# EAGLE design BrickPi 1.7.3 (EAGLE 6.4)
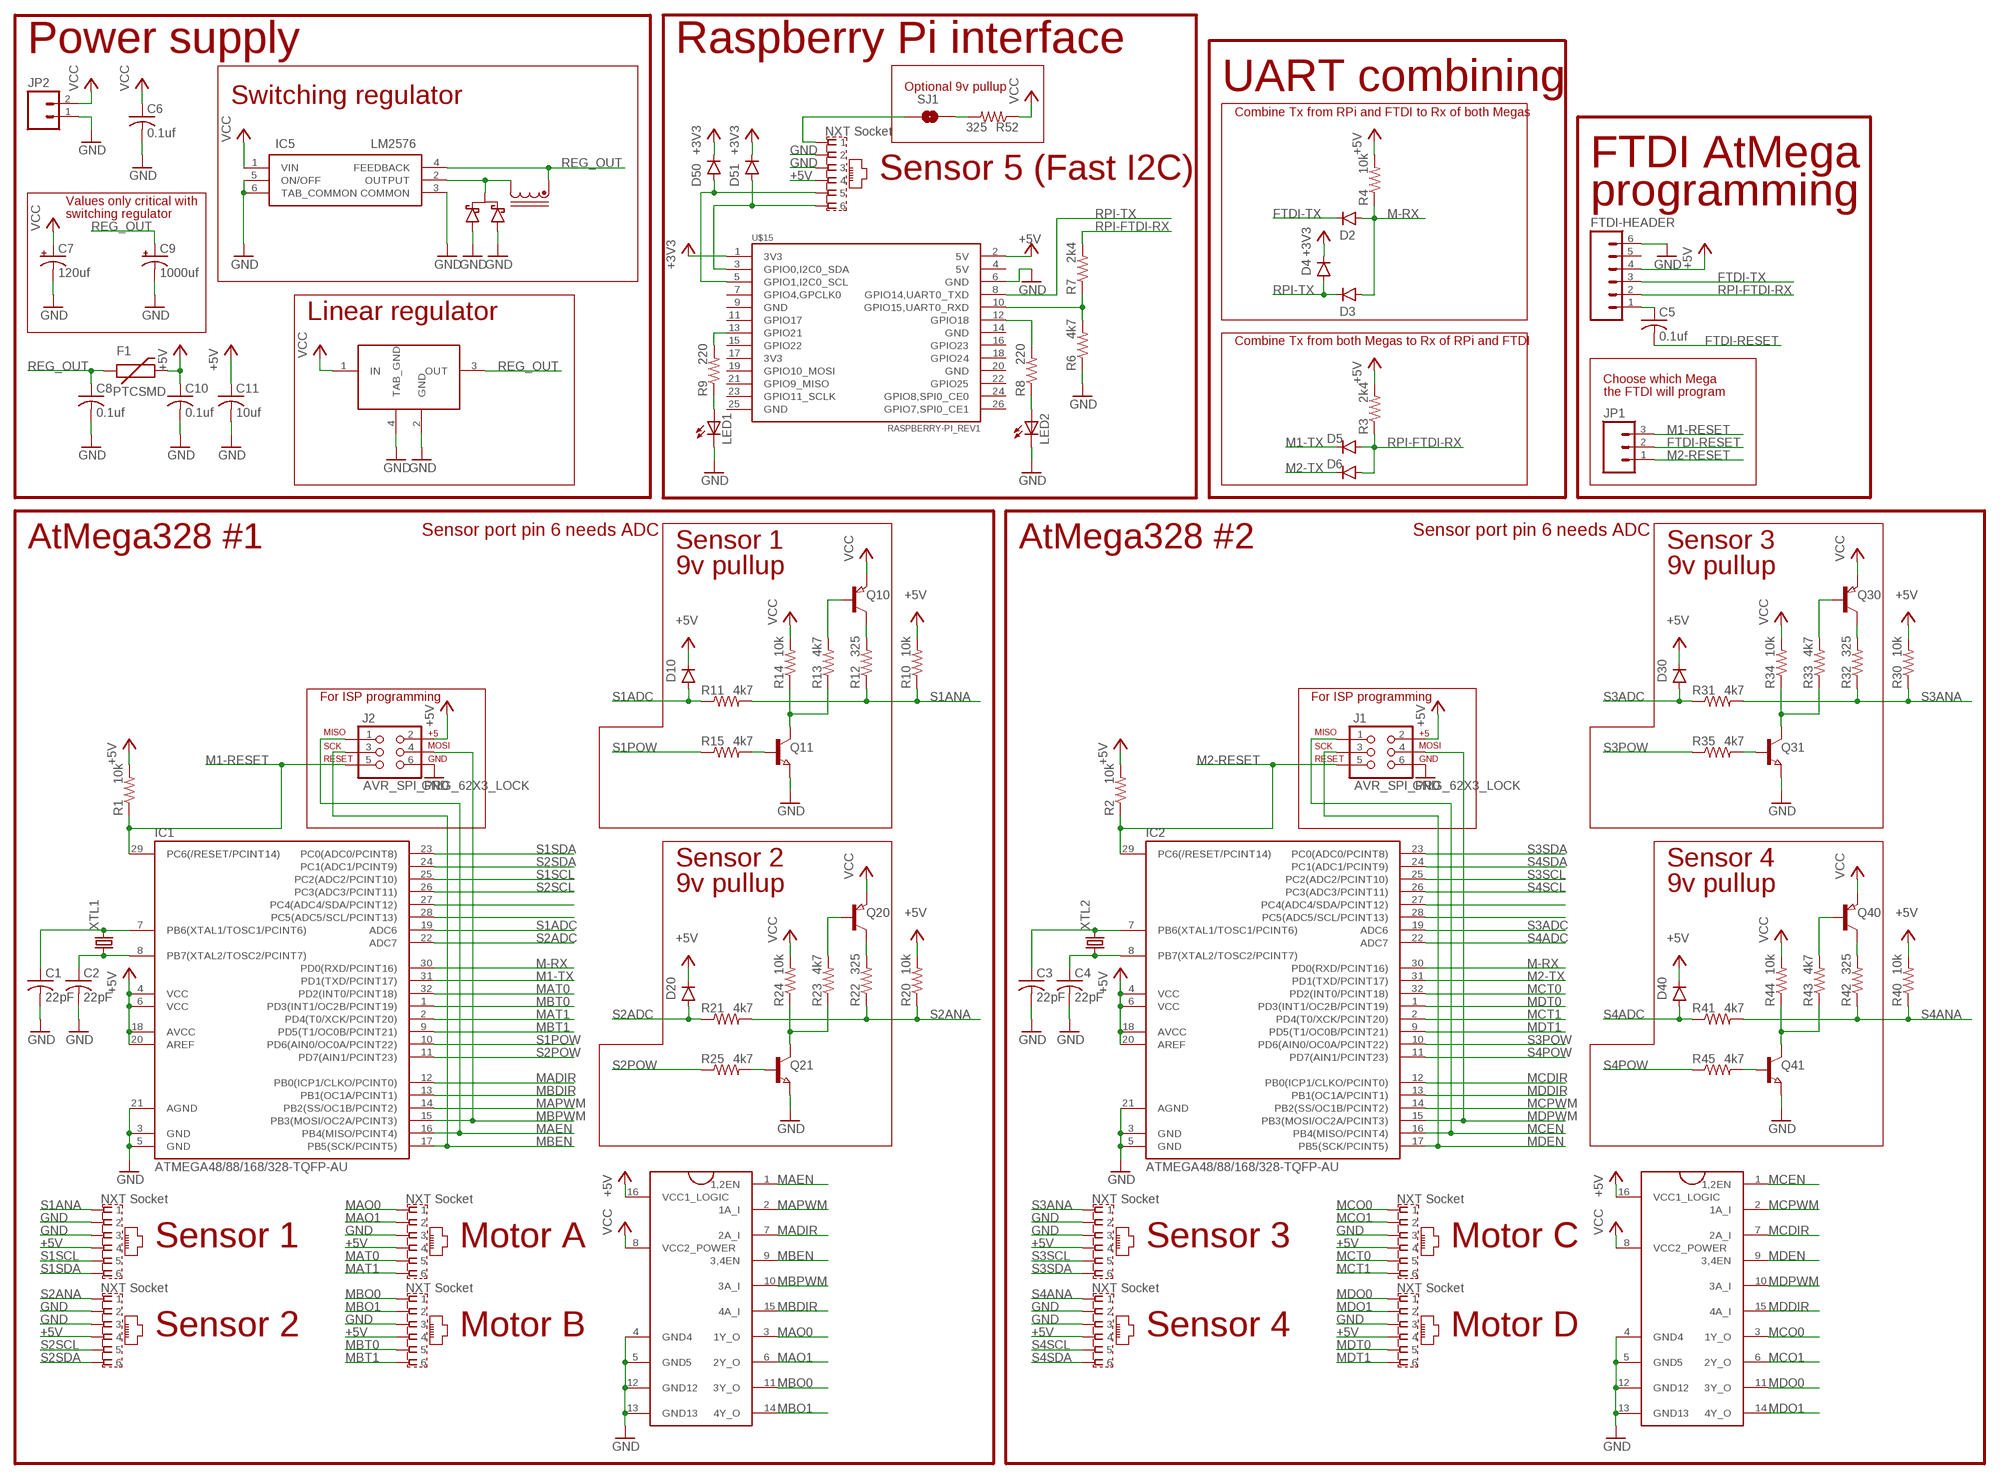
[diagram p0: schematic, sheet 1]

## Parts
C1  22pF  C-USC0805  [C0805]
C2  22pF  C-USC0805  [C0805]
C3  22pF  C-USC0805  [C0805]
C4  22pF  C-USC0805  [C0805]
C5  0.1uf  C-USC0805  [C0805]
C6  0.1uf  C-USC0805  [C0805]
C7  120uf  CPOL-USE2.5-6  [E2,5-6]
C8  0.1uf  C-USC0805  [C0805]
C9  1000uf  CPOL-USE3.5-10  [E3,5-10]
C10  0.1uf  C-USC0805  [C0805]
C11  10uf  C-USC0805  [C0805]
D1  DIODE_SCHOTTKY_VS-6CWQ04FNTRPBF  [DPAK]
D2  DIODESOD80  [SOD80]
D3  DIODESOD80  [SOD80]
D4  DIODESOD80  [SOD80]
D5  DIODESOD80  [SOD80]
D6  DIODESOD80  [SOD80]
D10  DIODESOD80  [SOD80]
D20  DIODESOD80  [SOD80]
D30  DIODESOD80  [SOD80]
D40  DIODESOD80  [SOD80]
D50  DIODESOD80  [SOD80]
D51  DIODESOD80  [SOD80]
F1  PTCSMD  [PTC-1206]
FTDI-HEADER  M06LOCK  [1X06_LOCK]
IC1  ATMEGA48/88/168/328-TQFP-AU  [TQFP32-08]
IC2  ATMEGA48/88/168/328-TQFP-AU  [TQFP32-08]
IC3  SN754410  [DIL16-ROUND-HEAT_DIS_SN754410]
IC4  SN754410  [DIL16-ROUND-HEAT_DIS_SN754410]
IC5  LM2576  REGULATOR_SWITCHING_LM2575_LM2576  [TO220-5-H]
IC6  REGULATOR_5V_TO220-H_7805  [TO220-H]
J1  AVR_SPI_PRG_62X3_LOCK  [2X3_LOCK]
J2  AVR_SPI_PRG_62X3_LOCK  [2X3_LOCK]
JP1  M03LOCK  [1X03_LOCK]
JP2  M02LOCK  [1X02_LOCK]
LED1  LED0805  [0805-LED]
LED2  LED0805  [0805-LED]
Q10  PNP-TRANSISTOR_SOT23  [SOT23]
Q11  NPN-TRANSISTOR_SOT23  [SOT23]
Q20  PNP-TRANSISTOR_SOT23  [SOT23]
Q21  NPN-TRANSISTOR_SOT23  [SOT23]
Q30  PNP-TRANSISTOR_SOT23  [SOT23]
Q31  NPN-TRANSISTOR_SOT23  [SOT23]
Q40  PNP-TRANSISTOR_SOT23  [SOT23]
Q41  NPN-TRANSISTOR_SOT23  [SOT23]
R1  10k  RESISTOR0603-RES  [0603]
R2  10k  RESISTOR0603-RES  [0603]
R3  2k4  RESISTOR0603-RES  [0603]
R4  10k  RESISTOR0603-RES  [0603]
R6  4k7  RESISTOR0603-RES  [0603]
R7  2k4  RESISTOR0603-RES  [0603]
R8  220  RESISTOR0603-RES  [0603]
R9  220  RESISTOR0603-RES  [0603]
R10  10k  RESISTOR0603-RES  [0603]
R11  4k7  RESISTOR0603-RES  [0603]
R12  325  RESISTOR1206  [1206]
R13  4k7  RESISTOR0603-RES  [0603]
R14  10k  RESISTOR0603-RES  [0603]
R15  4k7  RESISTOR0603-RES  [0603]
R20  10k  RESISTOR0603-RES  [0603]
R21  4k7  RESISTOR0603-RES  [0603]
R22  325  RESISTOR1206  [1206]
R23  4k7  RESISTOR0603-RES  [0603]
R24  10k  RESISTOR0603-RES  [0603]
R25  4k7  RESISTOR0603-RES  [0603]
R30  10k  RESISTOR0603-RES  [0603]
R31  4k7  RESISTOR0603-RES  [0603]
R32  325  RESISTOR1206  [1206]
R33  4k7  RESISTOR0603-RES  [0603]
R34  10k  RESISTOR0603-RES  [0603]
R35  4k7  RESISTOR0603-RES  [0603]
R40  10k  RESISTOR0603-RES  [0603]
R41  4k7  RESISTOR0603-RES  [0603]
R42  325  RESISTOR1206  [1206]
R43  4k7  RESISTOR0603-RES  [0603]
R44  10k  RESISTOR0603-RES  [0603]
R45  4k7  RESISTOR0603-RES  [0603]
R52  325  RESISTOR1206  [1206]
SJ1  SOLDERJUMPERNO  [SJ_2]
U$3  NXT-SOCKETREGULAR  [NXT-SOCKET]
U$4  NXT-SOCKETREGULAR  [NXT-SOCKET]
U$5  NXT-SOCKETREGULAR  [NXT-SOCKET]
U$7  NXT-SOCKETREGULAR  [NXT-SOCKET]
U$8  NXT-SOCKETREGULAR  [NXT-SOCKET]
U$9  NXT-SOCKETREGULAR  [NXT-SOCKET]
U$10  NXT-SOCKETREGULAR  [NXT-SOCKET]
U$11  NXT-SOCKETREGULAR  [NXT-SOCKET]
U$12  NXT-SOCKETREGULAR  [NXT-SOCKET]
U$14  INDUCTOR_PULSE_P0250.XXXNL  [INDUCTOR_PULSE_P0250.XXXNL]
U$15  RASPBERRY-PI_REV1  [RASPBERRY-PI_REV1]
XTL1  CRYSTALHC49S  [HC49/S]
XTL2  CRYSTALHC49S  [HC49/S]

## Nets
+3V3: D4.C D50.C D51.C U$15.1(3V3)
+5V: C10.1 C11.1 D10.C D20.C D30.C D40.C F1.2 FTDI-HEADER.4 IC1.4(VCC) IC1.6(VCC) IC1.18(AVCC) IC1.20(AREF) IC2.4(VCC) IC2.6(VCC) IC2.18(AVCC) IC2.20(AREF) IC3.16(VCC1_LOGIC) IC4.16(VCC1_LOGIC) J1.2 J2.2 R1.2 R2.2 R3.2 R4.2 R10.2 R20.2 R30.2 R40.2 U$3.4 U$4.4 U$5.4 U$7.4 U$8.4 U$9.4 U$10.4 U$11.4 U$12.4 U$15.2(5V)
FTDI-RESET: C5.2 JP1.2
FTDI-TX: D2.C FTDI-HEADER.3
GND: C1.2 C2.2 C3.2 C4.2 C6.2 C7.- C8.2 C9.- C10.2 C11.2 D1.1 D1.3 FTDI-HEADER.6 IC1.3(GND) IC1.5(GND) IC1.21(AGND) IC2.3(GND) IC2.5(GND) IC2.21(AGND) IC3.4(GND4) IC3.5(GND5) IC3.12(GND12) IC3.13(GND13) IC4.4(GND4) IC4.5(GND5) IC4.12(GND12) IC4.13(GND13) IC5.3(COMMON) IC5.5(ON/OFF) IC5.6(TAB_COMMON) IC6.2(GND) IC6.4(TAB_GND) J1.6 J2.6 JP2.1 LED1.2(C) LED2.2(C) Q11.2(E) Q21.2(E) Q31.2(E) Q41.2(E) R6.1 U$3.3 U$4.3 U$5.3 U$7.3 U$8.2 U$8.3 U$9.2 U$9.3 U$10.2 U$10.3 U$11.2 U$11.3 U$12.2 U$12.3 U$15.6(GND)
M1-RESET: IC1.29(PC6(/RESET/PCINT14)) J2.5 JP1.3 R1.1
M1-TX: D5.C IC1.31(PD1(TXD/PCINT17))
M2-RESET: IC2.29(PC6(/RESET/PCINT14)) J1.5 JP1.1 R2.1
M2-TX: D6.C IC2.31(PD1(TXD/PCINT17))
M-RX: D2.A D3.A IC1.30(PD0(RXD/PCINT16)) IC2.30(PD0(RXD/PCINT16)) R4.1
MADIR: IC1.12(PB0(ICP1/CLKO/PCINT0)) IC3.7(2A_I)
MAEN: IC1.16(PB4(MISO/PCINT4)) IC3.1(1,2EN) J2.1
MAO0: IC3.3(1Y_O) U$3.1
MAO1: IC3.6(2Y_O) U$3.2
MAPWM: IC1.14(PB2(SS/OC1B/PCINT2)) IC3.2(1A_I)
MAT0: IC1.32(PD2(INT0/PCINT18)) U$3.5
MAT1: IC1.2(PD4(T0/XCK/PCINT20)) U$3.6
MBDIR: IC1.13(PB1(OC1A/PCINT1)) IC3.15(4A_I)
MBEN: IC1.17(PB5(SCK/PCINT5)) IC3.9(3,4EN) J2.3
MBO0: IC3.11(3Y_O) U$4.1
MBO1: IC3.14(4Y_O) U$4.2
MBPWM: IC1.15(PB3(MOSI/OC2A/PCINT3)) IC3.10(3A_I) J2.4
MBT0: IC1.1(PD3(INT1/OC2B/PCINT19)) U$4.5
MBT1: IC1.9(PD5(T1/OC0B/PCINT21)) U$4.6
MCDIR: IC2.12(PB0(ICP1/CLKO/PCINT0)) IC4.7(2A_I)
MCEN: IC2.16(PB4(MISO/PCINT4)) IC4.1(1,2EN) J1.1
MCO0: IC4.3(1Y_O) U$5.1
MCO1: IC4.6(2Y_O) U$5.2
MCPWM: IC2.14(PB2(SS/OC1B/PCINT2)) IC4.2(1A_I)
MCT0: IC2.32(PD2(INT0/PCINT18)) U$5.5
MCT1: IC2.2(PD4(T0/XCK/PCINT20)) U$5.6
MDDIR: IC2.13(PB1(OC1A/PCINT1)) IC4.15(4A_I)
MDEN: IC2.17(PB5(SCK/PCINT5)) IC4.9(3,4EN) J1.3
MDO0: IC4.11(3Y_O) U$7.1
MDO1: IC4.14(4Y_O) U$7.2
MDPWM: IC2.15(PB3(MOSI/OC2A/PCINT3)) IC4.10(3A_I) J1.4
MDT0: IC2.1(PD3(INT1/OC2B/PCINT19)) U$7.5
MDT1: IC2.9(PD5(T1/OC0B/PCINT21)) U$7.6
N$1: D1.4 IC5.2(OUTPUT) U$14.P$2
N$2: C5.1 FTDI-HEADER.1
N$3: LED2.1(A) R8.1
N$4: LED1.1(A) R9.1
N$5: C1.1 IC1.7(PB6(XTAL1/TOSC1/PCINT6)) XTL1.2
N$6: R9.2 U$15.13(GPIO21)
N$7: C2.1 IC1.8(PB7(XTAL2/TOSC2/PCINT7)) XTL1.1
N$8: Q11.1(B) R15.2
N$9: Q20.3(C) R22.2
N$10: Q21.1(B) R25.2
N$11: R6.2 R7.1 U$15.10(GPIO15,UART0_RXD)
N$12: R8.2 U$15.12(GPIO18)
N$13: Q11.3(C) R13.1 R14.1
N$14: C3.1 IC2.7(PB6(XTAL1/TOSC1/PCINT6)) XTL2.2
N$15: C4.1 IC2.8(PB7(XTAL2/TOSC2/PCINT7)) XTL2.1
N$16: Q21.3(C) R23.1 R24.1
N$17: Q20.1(B) R23.2
N$18: IC2.27(PC4(ADC4/SDA/PCINT12))
N$19: IC2.28(PC5(ADC5/SCL/PCINT13))
N$20: Q30.3(C) R32.2
N$21: Q31.1(B) R35.2
N$22: Q10.1(B) R13.2
N$23: Q31.3(C) R33.1 R34.1
N$24: Q30.1(B) R33.2
N$25: Q10.3(C) R12.2
N$26: Q40.3(C) R42.2
N$27: IC1.27(PC4(ADC4/SDA/PCINT12))
N$28: IC1.28(PC5(ADC5/SCL/PCINT13))
N$29: SJ1.1 U$12.1
N$30: R52.2 SJ1.2
N$31: D51.A U$12.6 U$15.3(GPIO0,I2C0_SDA)
N$32: D50.A U$12.5 U$15.5(GPIO1,I2C0_SCL)
N$33: Q41.1(B) R45.2
N$34: Q41.3(C) R43.1 R44.1
N$35: Q40.1(B) R43.2
REG_OUT: C8.1 C9.+ F1.1 IC5.4(FEEDBACK) IC6.3(OUT) U$14.P$1
RPI-FTDI-RX: D5.A D6.A FTDI-HEADER.2 R3.1 R7.2
RPI-TX: D3.C D4.A U$15.8(GPIO14,UART0_TXD)
S1ADC: D10.A IC1.19(ADC6) R11.1
S1ANA: R10.1 R11.2 R12.1 U$8.1
S1POW: IC1.10(PD6(AIN0/OC0A/PCINT22)) R15.1
S1SCL: IC1.25(PC2(ADC2/PCINT10)) U$8.5
S1SDA: IC1.23(PC0(ADC0/PCINT8)) U$8.6
S2ADC: D20.A IC1.22(ADC7) R21.1
S2ANA: R20.1 R21.2 R22.1 U$9.1
S2POW: IC1.11(PD7(AIN1/PCINT23)) R25.1
S2SCL: IC1.26(PC3(ADC3/PCINT11)) U$9.5
S2SDA: IC1.24(PC1(ADC1/PCINT9)) U$9.6
S3ADC: D30.A IC2.19(ADC6) R31.1
S3ANA: R30.1 R31.2 R32.1 U$10.1
S3POW: IC2.10(PD6(AIN0/OC0A/PCINT22)) R35.1
S3SCL: IC2.25(PC2(ADC2/PCINT10)) U$10.5
S3SDA: IC2.23(PC0(ADC0/PCINT8)) U$10.6
S4ADC: D40.A IC2.22(ADC7) R41.1
S4ANA: R40.1 R41.2 R42.1 U$11.1
S4POW: IC2.11(PD7(AIN1/PCINT23)) R45.1
S4SCL: IC2.26(PC3(ADC3/PCINT11)) U$11.5
S4SDA: IC2.24(PC1(ADC1/PCINT9)) U$11.6
VCC: C6.1 C7.+ IC3.8(VCC2_POWER) IC4.8(VCC2_POWER) IC5.1(VIN) IC6.1(IN) JP2.2 Q10.2(E) Q20.2(E) Q30.2(E) Q40.2(E) R14.2 R24.2 R34.2 R44.2 R52.1
Unconnected: FTDI-HEADER.5 U$15.4(5V) U$15.7(GPIO4,GPCLK0) U$15.9(GND) U$15.11(GPIO17) U$15.14(GND) U$15.15(GPIO22) U$15.16(GPIO23) U$15.17(3V3) U$15.18(GPIO24) U$15.19(GPIO10_MOSI) U$15.20(GND) U$15.21(GPIO9_MISO) U$15.22(GPIO25) U$15.23(GPIO11_SCLK) U$15.24(GPIO8,SPI0_CE0) U$15.25(GND) U$15.26(GPIO7,SPI0_CE1)

## Notes on the sheet
- Power supply | Raspberry Pi interface
- Optional 9v pullup | UART combining
- Switching regulator
- Combine Tx from RPi and FTDI to Rx of both Megas
- FTDI AtMega
- Sensor 5 (Fast I2C)
- Values only critical with | programming
- switching regulator
- Linear regulator
- Combine Tx from both Megas to Rx of RPi and FTDI
- Choose which Mega
- the FTDI will program
- Sensor port pin 6 needs ADC | Sensor port pin 6 needs ADC
- AtMega328 #1 | Sensor 1 | AtMega328 #2 | Sensor 3
- 9v pullup | 9v pullup
- For ISP programming | For ISP programming
- Sensor 2 | Sensor 4
- 9v pullup | 9v pullup
- Sensor 1 | Motor A | Sensor 3 | Motor C
- Sensor 2 | Motor B | Sensor 4 | Motor D

## Library data of the parts
C1-C6 C8 C10 C11 = rcl:C-US: CAPACITOR, American symbol
C7 C9 = rcl:CPOL-US: POLARIZED CAPACITOR, American symbol
D1 = zz My Parts:DIODE_SCHOTTKY_VS-6CWQ04FNTRPBF
D2-D6 D10 D20 D30 D40 D50 D51 = zz My Parts:DIODE
F1 = zz SparkFun:PTC: Resettable Fuse PTC Resettable Fuse. Spark Fun Electronics SKU : COM-08357
FTDI-HEADER = zz SparkFun:M06: Header 6 Standard 6-pin 0.1" header. Use with straight break away headers (SKU : PRT-00116), right angle break away headers (PRT-00553), swiss pins (PRT-00743), machine pins (PRT-00117), and female headers (PRT-00115). Molex polarized connector foot print use with SKU : PRT-08094 with associated crimp pins and housings. NOTES ON THE VARIANTS LOCK and LOCK_LONGPADS... This footprint was designed to help hold the alignment of a through-hole component (i.e. 6-pin header) while soldering it into place. You may notice that each hole has been shifted either up or down by 0.005 of an inch from it's more standard position (which is a perfectly straight line). This slight alteration caused the pins (the squares in the middle) to touch the edges of the holes. Because they are alternating, it causes a "brace" to hold the component in place. 0.005 has proven to be the perfect amount of "off-center" position when using our standard breakaway headers. Although looks a little odd when you look at the bare footprint, once you have a header in there, the alteration is very hard to notice. Also, if you push a header all the way into place, it is covered up entirely on the bottom side. This idea of altering the position of holes to aid alignment will be further integrated into the Sparkfun Library for other footprints. It can help hold any component with 3 or more connection pins.
IC1 IC2 = zz My Parts:ATMEGA48/88/168/328-TQFP
IC3 IC4 = zz My Parts:SN754410
IC5 = zz My Parts:REGULATOR_SWITCHING_LM2575_LM2576
IC6 = zz My Parts:REGULATOR_5V_TO220-H_7805
J1 J2 = zz My Parts:AVR_SPI_PRG_6: AVR ISP 6 Pin This is the reduced ISP connector for AVR programming. Common on Arduino. This footprint will take up less PCB space and can be used with a 10-pin to 6-pin adapter such as SKU: BOB-08508
JP1 = zz SparkFun:M03: Header 3 Standard 3-pin 0.1" header. Use with straight break away headers (SKU : PRT-00116), right angle break away headers (PRT-00553), swiss pins (PRT-00743), machine pins (PRT-00117), and female headers (PRT-00115). Molex polarized connector foot print use with SKU : PRT-08232 with associated crimp pins and housings.
JP2 = zz SparkFun:M02: Header 2 Standard 2-pin 0.1" header. Use with straight break away headers (SKU : PRT-00116), right angle break away headers (PRT-00553), swiss pins (PRT-00743), machine pins (PRT-00117), and female headers (PRT-00115). Molex polarized connector foot print use with SKU : PRT-08233 with associated crimp pins and housings.
LED1 LED2 = zz My Parts:LED: LEDs Standard schematic elements and footprints for 5mm, 3mm, 1206, and 0603 sized LEDs. 5mm - Spark Fun Electronics SKU : COM-00529 (and others)
Q10 Q20 Q30 Q40 = semicon-smd-ipc:PNP-TRANSISTOR_: PNP TRANSISTOR
Q11 Q21 Q31 Q41 = semicon-smd-ipc:NPN-TRANSISTOR_: NPN TRANSISTOR
R1-R4 R6-R15 R20-R25 R30-R35 R40-R45 R52 = zz My Parts:RESISTOR: Resistor Basic schematic elements and footprints for resistors. 0603 and 0805 are mine.
SJ1 = zz My Parts:SOLDERJUMPER: Solder Jumper Standard SMD solder jumper. Used to automate production. Two varients : Normally Open and Normally Closed are the same, but have different paste layers. NC will have a large amount of paste and should jumper during reflow.
U$3-U$5 U$7-U$12 = zz My Parts:NXT-SOCKET: NXT Socket
U$14 = zz My Parts:INDUCTOR_PULSE_P0250.XXXNL
U$15 = RaspberryPi:RASPBERRY-PI_REV1: Raspberry Pi Board <http://www.raspberrypi.org/> Jacques Lagnel V1.0 (beta) 2012 Mateusz Bawaj V1.1 (beta) 2012 Board dimension: Forum 3D model <http://www.raspberrypi.org/forum/general-discussion/mechanical-profile-3d-models?value=3d%20model&type=1&include=1&search=1&ret=all> The GPIO Connector (P1): http://elinux.org/RPi_Low-level_peripherals
XTL1 XTL2 = crystal:CRYSTAL: CRYSTAL; OC_FARNELL: 1667008; OC_NEWARK: unknown

## Board
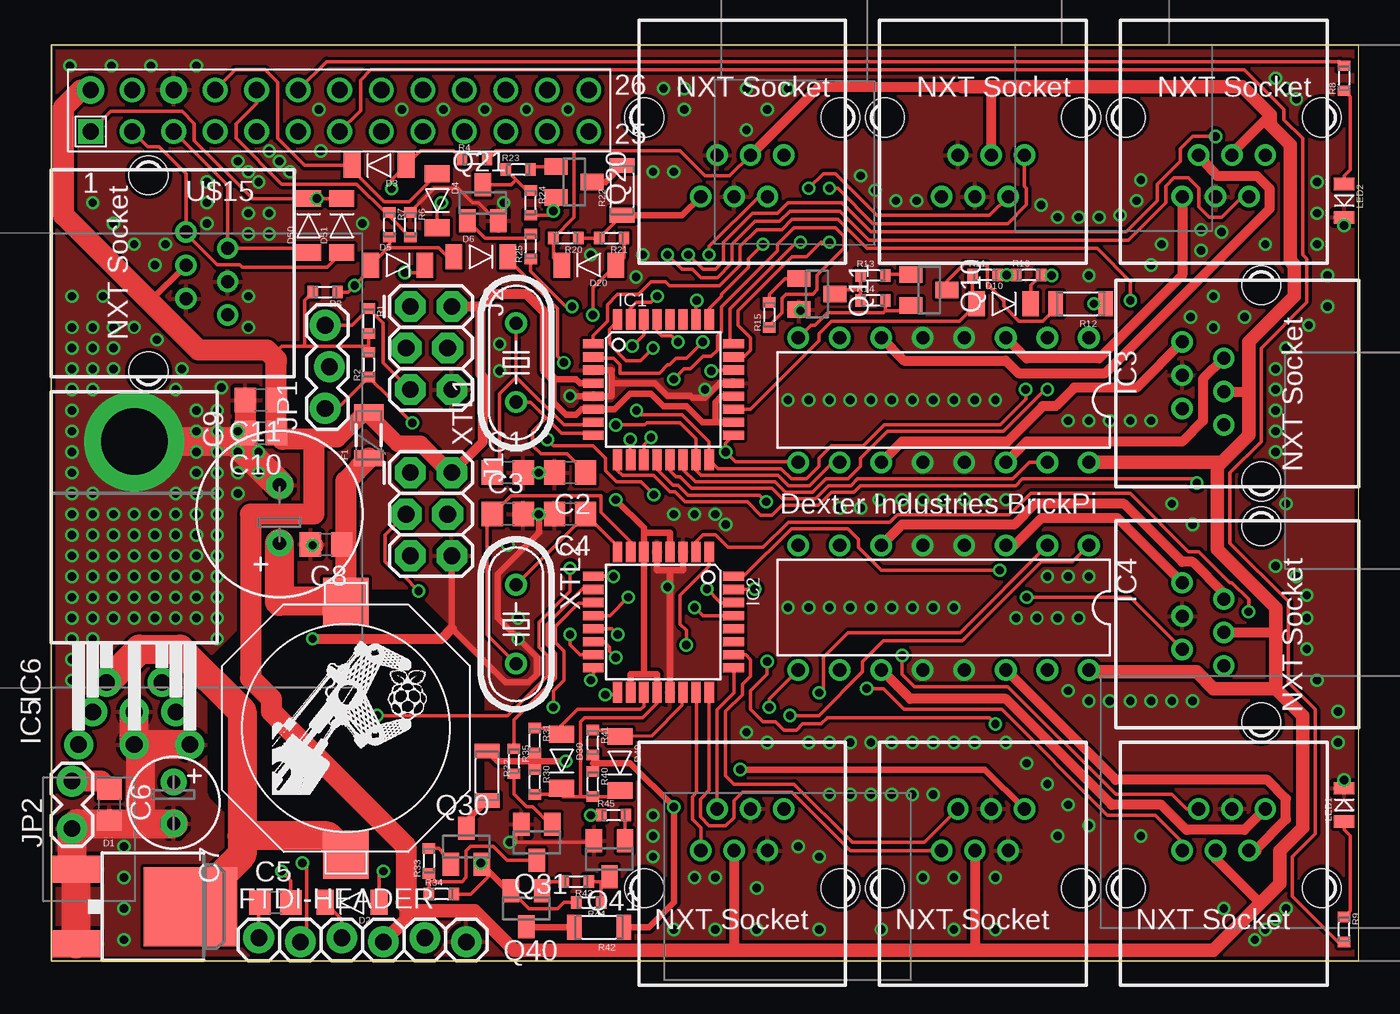
[diagram p1: board, top side]
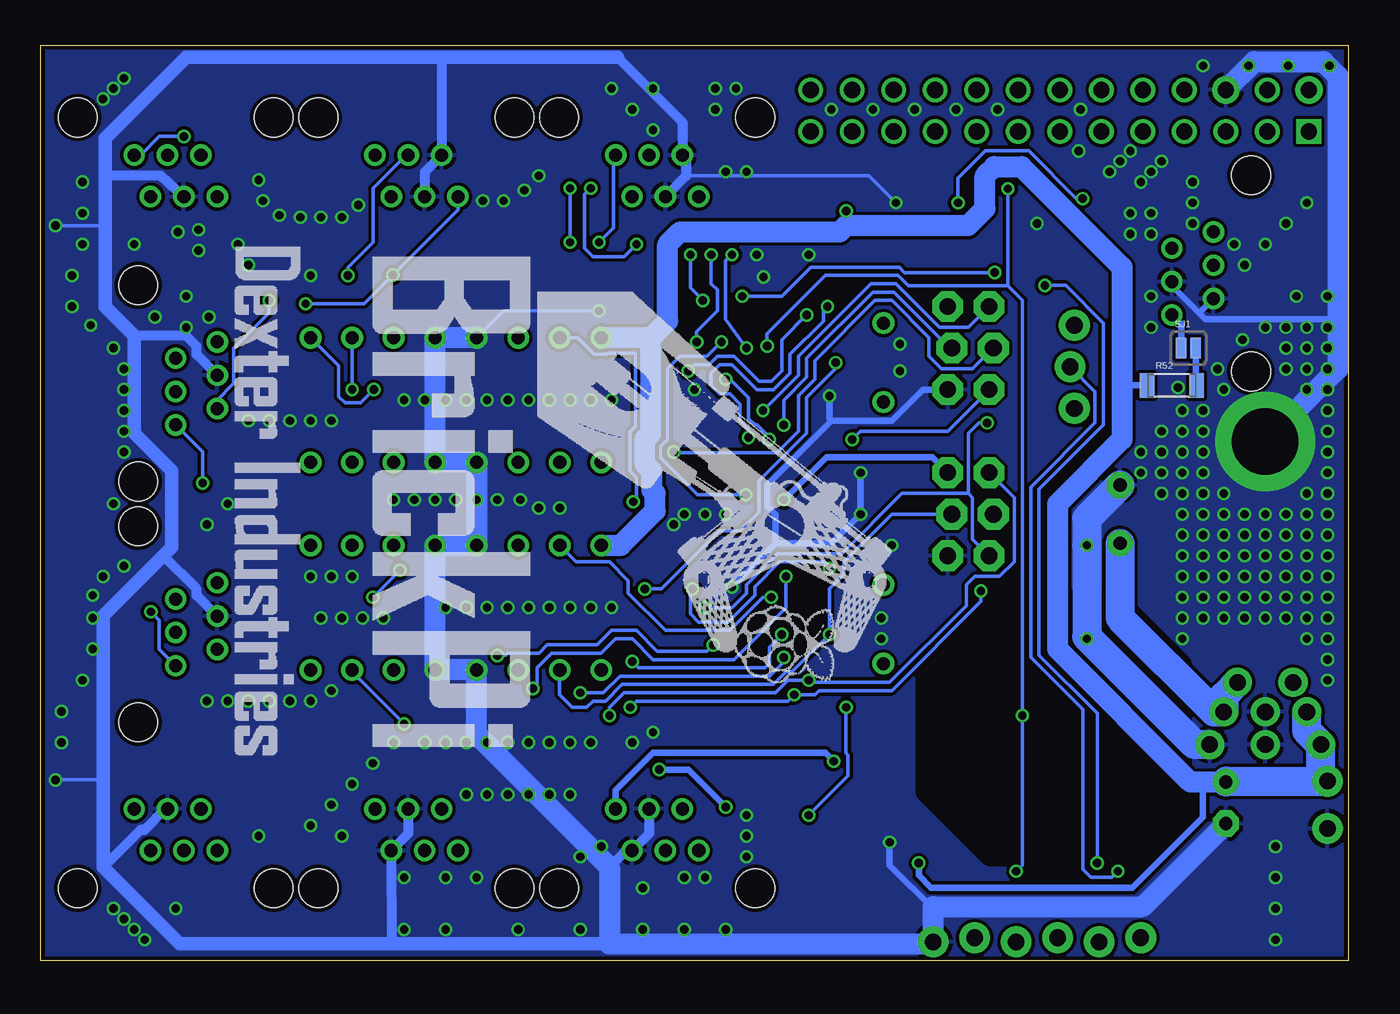
[diagram p2: board, bottom side, seen from below]

Size 80.01 x 56.01 mm. Coordinates in mm from the lower left corner, seen from the top.
Outline: 0,0 80.01,0 80.01,56.01 0,56.01 0,0
Copper layers (1*16): Top 0.035mm / dielectric 1.5mm / Bottom 0.035mm
Design rules "Fusion_eagle_rule_v1.1 *": minimum track width 6mil, minimum drill 12mil, track to track 6mil, track to pad 6mil, pad to pad 6mil, via to via 6mil, smd to smd 0mil, copper to edge 10mil, drill to drill 10mil, minimum pad ring 10mil, minimum via ring 6mil, stop-mask expansion 0mil, vias tented up to drill 100mil, thermal gap 10mil
tRestrict: area 10.4,6.6 to 25.7,21.8
bRestrict: area 10.4,6.6 to 25.7,21.8

### Footprints (pad centres in the part's own frame; a part is rotated, then mirrored left to right if it is on the bottom)
C0805 = smd 1.3 x 1.5: 1 -0.95,0; 2 0.95,0
E2,5-6 = drill 0.813 pad 1.6: + -1.27,0 | drill 0.813 pad 1.6 octagon: - 1.27,0
E3,5-10 = drill 0.813 pad 1.6: + -1.778,0 | drill 0.813 pad 1.6 octagon: - 1.778,0
DPAK = smd 1.651 x 2.921: 1 -2.286,-5.334; 3 2.286,-5.334 | smd 4.826 x 5.715: 4 0,1.651
SOD80 = smd 1.016 x 1.524: A -1.651,0; C 1.651,0
PTC-1206 = smd 1 x 1.8: 1 -1.4,0; 2 1.4,0
1X06_LOCK = drill 1.016 pad 1.88: 1 0,0; 2 2.54,-0.254; 3 5.08,0; 4 7.62,-0.254; 5 10.16,0; 6 12.7,-0.254
TQFP32-08 = smd 1.27 x 0.559: 1 -4.293,2.8; 2 -4.293,2; 3 -4.293,1.2; 4 -4.293,0.4; 5 -4.293,-0.4; 6 -4.293,-1.2; 7 -4.293,-2; 8 -4.293,-2.8; 17 4.293,-2.8; 18 4.293,-2; 19 4.293,-1.2; 20 4.293,-0.4; 21 4.293,0.4; 22 4.293,1.2; 23 4.293,2; 24 4.293,2.8 | smd 0.559 x 1.27: 9 -2.8,-4.293; 10 -2,-4.293; 11 -1.2,-4.293; 12 -0.4,-4.293; 13 0.4,-4.293; 14 1.2,-4.293; 15 2,-4.293; 16 2.8,-4.293; 25 2.8,4.293; 26 2,4.293; 27 1.2,4.293; 28 0.4,4.293; 29 -0.4,4.293; 30 -1.2,4.293; 31 -2,4.293; 32 -2.8,4.293
DIL16-ROUND-HEAT_DIS_SN754410 = drill 0.813: 1 -8.89,-3.81; 2 -6.35,-3.81; 3 -3.81,-3.81; 4 -1.27,-3.81; 5 1.27,-3.81; 6 3.81,-3.81; 7 6.35,-3.81; 8 8.89,-3.81; 9 8.89,3.81; 10 6.35,3.81; 11 3.81,3.81; 12 1.27,3.81; 13 -1.27,3.81; 14 -3.81,3.81; 15 -6.35,3.81; 16 -8.89,3.81
TO220-5-H = drill 1.016 pad 1.778: 1 -3.404,-21.59; 2 -1.702,-17.78; 3 0,-21.59; 4 1.702,-17.78; 5 3.404,-21.59 | drill 4.064 pad 6.096: 6 0,-3.048
TO220-H = drill 1.016 pad 1.778: 1 -2.54,-19.583; 2 0,-19.583; 3 2.54,-19.583 | drill 4.064 pad 6.096: 4 0,-3.048
2X3_LOCK = drill 1.016 pad 1.88 octagon: 1 0,0; 2 0,2.54; 3 2.54,-0.254; 4 2.54,2.286; 5 5.08,0; 6 5.08,2.54
1X03_LOCK = drill 1.016 pad 1.88: 1 0,0.127; 2 2.54,-0.127; 3 5.08,0.127
1X02_LOCK = drill 1.016 pad 1.88: 1 -0.178,0; 2 2.718,0
0805-LED = smd 0.762 x 1.27: 1 -1.016,0; 2 1.016,0
SOT23 = smd 1 x 1.4: 1 -0.95,-1.1; 2 0.95,-1.1; 3 0,1.1
0603 = smd 0.635 x 0.762: 1 -0.762,0; 2 0.762,0
1206 = smd 0.889 x 1.524: 1 -1.524,0; 2 1.524,0
SJ_2 = smd 0.635 x 1.27: 1 -0.445,0; 2 0.445,0
NXT-SOCKET = drill 0.8 pad 1.3: 1 0,0; 2 -1,-2.54; 3 -2.04,0; 4 -3.04,-2.54; 5 -4.08,0; 6 -5.08,-2.54 | hole 2.36: -8.54,-4.84; 3.46,-4.84
INDUCTOR_PULSE_P0250.XXXNL = smd 2.794 x 2.921: P$1 0,7.747; P$2 0,-7.747
RASPBERRY-PI_REV1 = drill 1 square: 1 -41.91,21.59 | drill 1 pad 1.676: 2 -41.91,24.13; 6 -36.83,24.13 | drill 1: 3 -39.37,21.59; 4 -39.37,24.13; 5 -36.83,21.59; 7 -34.29,21.59; 8 -34.29,24.13; 9 -31.75,21.59; 10 -31.75,24.13; 11 -29.21,21.59; 12 -29.21,24.13; 13 -26.67,21.59; 14 -26.67,24.13; 15 -24.13,21.59; 16 -24.13,24.13; 17 -21.59,21.59; 18 -21.59,24.13; 19 -19.05,21.59; 20 -19.05,24.13; 21 -16.51,21.59; 22 -16.51,24.13; 23 -13.97,21.59; 24 -13.97,24.13; 25 -11.43,21.59; 26 -11.43,24.13
HC49/S = drill 0.813: 1 -2.413,0; 2 2.413,0

### Placement (x,y rotation side)
C1  27.94,29.84 0 top
C2  31.75,29.84 180 top
C3  27.94,27.3 0 top
C4  31.75,27.3 180 top
C5  13.72,3.56 0 top
C6  3.56,9.53 270 top
C7  7.49,9.65 270 top
C8  16.82,25.45 180 top
C9  13.97,27.3 90 top
C10  12.83,32.26 180 top
C11  12.83,34.29 180 top
D1  6.86,3.3 270 top
D2  18.41,3.56 180 top
D3  20.07,48.64 180 top
D4  23.62,46.48 270 top
D5  21.21,42.55 0 top
D6  26.29,43.05 0 top
D10  58.29,40.18 0 top
D20  32.89,42.55 180 top
D30  31.24,12.19 270 top
D40  34.8,12.06 270 top
D50  15.75,44.96 90 top
D51  17.78,44.96 90 top
F1  19.43,32.13 90 top
FTDI-HEADER  12.7,1.4 0 top
IC1  37.47,34.92 0 top
IC2  37.47,20.7 270 top
IC3  54.61,34.29 180 top
IC4  54.61,21.59 180 top
IC5  5.08,34.8 0 top
IC6  5.08,34.8 0 top
J1  21.97,29.84 270 top
J2  21.97,40.01 270 top
JP1  16.89,33.78 90 top
JP2  1.27,8.26 90 top
LED1  79.12,9.53 90 top
LED2  79.12,46.48 270 top
Q10  53.72,41.02 270 top
Q11  46.86,40.77 270 top
Q20  32,47.62 270 top
Q21  26.42,46.35 0 top
Q30  25.4,6.99 0 top
Q31  29.72,7.24 180 top
Q40  29.08,3.17 180 top
Q41  34.16,6.22 180 top
R1  19.43,39.12 270 top
R2  19.43,36.45 90 top
R3  16.76,40.89 180 top
R4  25.91,49.02 0 top
R6  21.97,45.01 270 top
R7  20.7,45.01 270 top
R8  79.12,53.98 90 top
R9  79.12,1.91 270 top
R10  59.82,41.94 0 top
R11  57.15,41.94 0 top
R12  62.99,40.18 180 top
R13  50.29,41.91 0 top
R14  50.29,40.39 0 top
R15  43.94,39.5 90 top
R20  31.5,44.2 180 top
R21  34.29,44.2 180 top
R22  34.92,47.12 90 top
R23  28.57,48.39 0 top
R24  29.34,46.35 270 top
R25  29.34,43.69 90 top
R30  29.59,10.92 270 top
R31  29.59,13.46 270 top
R32  26.67,11.3 270 top
R33  23.11,6.1 90 top
R34  23.88,4.06 0 top
R35  28.32,12.19 270 top
R40  33.15,10.79 270 top
R41  33.15,13.34 270 top
R42  33.53,2.03 180 top
R43  32.13,4.83 180 top
R44  32.89,3.56 180 top
R45  34.42,8.89 0 top
R52  10.79,35.18 0 bottom
SJ1  9.78,37.47 0 bottom
U$3  69.22,46.74 180 top
U$4  69.22,37.85 90 top
U$5  69.22,23.11 90 top
U$7  74.3,9.27 0 top
U$8  54.48,46.74 180 top
U$9  39.75,46.74 180 top
U$10  44.83,9.27 0 top
U$11  59.56,9.27 0 top
U$12  10.79,39.5 270 top
U$14  18.03,14.22 0 top
U$15  44.32,29.13 0 top
XTL1  28.45,36.58 90 top
XTL2  28.45,20.57 270 top

### Tracks (layer width: path | path; a pad name or v marks a point on that pad's centre or on a via)
+3V3  (via drill 0.51)
  Top 0.203: U$15.1 3.63,51.94 8,51.94 8.76,51.18 8.76,50.16 12.32,46.61 v16.26,46.61 | v23.88,46.35 23.62,46.1 D4.C | D51.C v16.26,46.61 | v16.26,46.61 D50.C v16.26,46.61
  Bottom 0.203: v16.26,46.61 16.64,46.61 19.56,49.53 22.2,49.53 23.88,47.85 v23.88,46.35
+5V  (via drill 0.51)
  Top 0.203: R2.2 19.43,37.59 | 19.43,37.59 R1.2 | 15.49,37.59 19.43,37.59 | 15.49,37.59 15.49,40.39 R3.2 | D20.C 30.73,43 R20.2 32,45.47 32,49.53 | R4.2 27.18,49.53 32,49.53 | U$9.4 41.52,48.01 40.01,48.01 38.48,49.53 32,49.53 | R30.2 30.78,10.16 D30.C 31.32,10.03 32.38,10.03 | D40.C 34.34,10.03 R40.2 32.38,10.03 | IC2.20 37.06,15.73 36.2,14.86 32.64,14.86 32.38,14.61 32.38,10.03 | D10.C 59.94,41.3 R10.2 61.19,41.94 v61.21,41.91 | 15.49,37.59 14.1,37.59 13.53,37.02
  Top 0.406: IC2.18 35.47,17.53 36.32,17.53 | 36.32,17.53 37.06,17.53 IC2.20 | 36.27,26.16 IC2.6 36.27,17.58 36.32,17.53 | 36.27,26.16 37.08,26.16 37.87,26.16 IC2.4 | U$12.4 6.03,40.32 | v34.54,28.19 36.27,26.47 36.27,26.16 | IC1.4 32.37,35.33 32.13,35.56 30.73,35.56 30.73,34.16 31.5,33.4 32.13,33.4 32.45,33.73 IC1.6 34.49,33.73 35.43,34.67 36.7,34.67 37.47,33.91 38.86,33.91 39.75,33.02 39.85,32.92 40.64,32.92 40.77,32.92 | IC1.18 40.77,32.92 | IC1.20 41,34.52 40.64,34.16 40.64,33.05 40.77,32.92
  Top 0.61: U$8.4 57.52,53.46 57.53,53.47 | 72.25,49.4 74.61,51.75 | U$7.4 71.25,6.21 73.98,3.49 | U$11.4 56.52,0.64 | U$10.4 41.79,0.75 | U$9.4 46.98,53.47 55.75,53.47 | U$5.4 74.92,20.07 74.93,20.07 | U$4.4 73.27,34.81 73.28,33.78 | J1.2 26.42,31.75 26.42,35.69 26.29,35.81 26.29,40.01 | 26.29,40.01 J2.2 | 26.29,40.01 27.05,40.77 29.08,40.77 30.23,39.62 30.23,36.07 30.73,35.56
  Top 0.813: 56.52,0.64 71.12,0.64 73.98,3.49 75.18,4.7 75.18,6.73 76.58,8.13 76.58,14.99 74.93,16.64 | 56.52,0.64 41.91,0.64 | 41.91,0.64 34.29,0.64 31.88,0.64 28.32,0.64 25.91,3.05 23.37,3.05 21.72,3.05 | U$3.4 72.25,49.4 | 56.52,0.64 | 41.79,0.75 41.91,0.64 | 55.75,53.47 57.53,53.47 72.9,53.47 74.61,51.75 74.61,51.12 75.82,49.91 75.82,42.8 76.07,42.55 76.07,40.64 73.28,37.85 73.28,33.78 73.28,32.13 71.63,30.48 71.37,30.48 | 21.72,3.05 21.72,2.54 FTDI-HEADER.4 | IC3.16 71.37,30.48 | IC4.16 63.63,17.65 70.1,17.65 71.12,16.64 74.93,16.64 | 71.37,30.48 71.37,25.15 74.93,21.59 74.93,20.07 74.93,16.64 | 21.72,3.56 21.72,3.05
  Top 1.016: F1.2 19.18,33.53 17.53,31.88 16.06,31.88 | J1.2 24.38,29.84 22.61,31.62 21.21,31.62 19.43,33.4 F1.2 | F1.2
  Top 1.27: U$15.2 1.83,53.26 0.76,52.2 0.76,45.59 6.03,40.32 9.02,37.34 13.21,37.34 13.53,37.02 13.78,36.77 13.78,36.58 | C11.1 C10.1 14.16,31.88 16.06,31.88 16.06,27.3 12.19,27.3 12.19,17.27 13.46,16 13.46,15.24 21.72,6.99 21.72,3.56 | C11.1 13.78,36.58 | C11.1 13.78,36.58
  Bottom 0.203: v61.21,41.91 61.21,42.42 59.69,43.94 59.69,47.24 57.66,49.28 U$8.4
  Bottom 0.406: J1.2 25.46,30.8 31.94,30.8 v34.54,28.19
FTDI-RESET  (via drill 0.51)
  Top 0.203: v14.1,5.46 14.67,4.89 C5.2
  Bottom 0.203: JP1.2 15.49,34.8 15.49,32.89 19.43,28.96 19.43,18.54 16.26,15.37 16.26,5.59 15.75,5.08 14.48,5.08 v14.1,5.46
FTDI-TX
  Top 0.203: FTDI-HEADER.3 17.78,2.54 D2.C
GND  (via drill 0.51)
  Top 0.203: C4.2 v29.84,27.3 C3.2 | C2.2 v29.84,29.84 C1.2 | LED1.2 v79.12,11.05 | LED2.2 v79.12,44.96 | Q11.2 45.78,39.82 v45.85,39.75 | R6.1 23.44,47.24 24.89,47.24 25.78,46.35 26.16,46.35 27.26,45.26 Q21.2 27.69,45.58 v27.69,46.35 | Q41.2 33.13,7.24 28.45,7.24 | 28.45,7.24 v28.07,7.24 | Q31.2 28.45,8.02 28.45,7.24
  Top 0.406: IC2.5 37.06,23.88 37.85,23.88 | 37.85,23.88 37.97,23.88 38.66,23.88 IC2.3 | IC2.21 37.87,22.86 | 37.87,22.86 37.87,23.86 37.85,23.88 | IC1.3 34.29,36.12 34.29,35.31 | 34.29,35.31 34.29,34.52 IC1.5 31.77,34.52 v31.75,34.54 | v29.84,27.3 29.84,26.16 27.3,23.62 27.3,20.95 29.72,18.54 29.72,17.53 29.21,17.02 27.81,17.02 24.51,20.32 J1.6 | v37.72,22.86 37.87,22.86 | 34.29,35.31 34.31,35.33 36.94,35.33 37.72,34.54 39.12,34.54 39.24,34.42 40.01,34.42 40.89,35.31 41.74,35.31 IC1.21
  Top 0.61: v16,19.68 23.88,19.68 24.51,20.32
  Top 1.27: C6.2 3.56,8.38 | 11.3,31.75 11.3,31.68 C10.2 C11.2 | C8.2 15.95,25.45 v16,25.4
  Top 1.778: D1.3 D1.1 1.27,5.84 JP2.1 1.57,8.38 3.56,8.38 5.46,8.38 | 5.46,8.38 C7.- | C9.- 11.3,31.75 IC6.4 | IC5.5 5.46,13.21 | 5.46,13.21 IC5.3 IC6.2 | 5.46,8.38 5.46,13.21
  Bottom 0.203: v79.12,11.05 76.2,11.05 | v79.12,44.96 76.07,44.96 | v45.85,39.75 51.69,39.75 IC3.5 | 40.52,48.01 29.34,48.01 v27.69,46.35
  Bottom 0.406: 35.05,25.53 31.62,25.53 v29.84,27.3 v29.84,29.84 | 35.05,25.53 v37.72,22.86 | U$12.3 10.79,41.27 9.14,39.62 | 9.14,39.62 8.76,39.24 0.64,39.24 | J2.6 26.04,34.92 27.94,33.02 31.62,33.02 | 31.62,33.02 35.56,29.08 35.56,27.81 35.05,27.3 35.05,25.53 | 31.62,33.02 31.75,33.15 v31.75,34.54 | v28.07,7.24 28.07,5.84 25.4,3.17 | U$12.2 9.13,39.62 9.14,39.62
  Bottom 0.61: U$9.3 40.52,48.01 40.52,49.05 U$9.2 40.75,51.29 44.7,55.24 | U$4.3 70.48,37.08 70.48,37.59 71.12,38.23 74.3,38.23 | U$3.3 72.65,48.01 76.07,48.01 | 72.39,9.27 73.66,8 73.91,8 76.2,5.71 | U$5.3 70.48,22.34 70.48,22.73 72.52,24.77 | 16,19.81 16.13,19.68 v16,19.68 | U$10.3 42.79,7.77 U$10.2 44.2,6.73 45.21,5.71 | U$11.3 57.52,7.77 U$11.2 58.55,1.02 | 55.5,55.24 U$8.2 56.52,48.24 U$8.3
  Bottom 0.813: 45.21,1.02 58.55,1.02 71.5,1.02 76.2,5.71 76.2,11.05 76.2,21.08 72.52,24.77 72.01,25.27 72.01,29.97 74.3,32.26 74.3,38.23 76.07,40.01 76.07,44.96 76.07,48.01 76.07,50.29 71.12,55.24 55.5,55.24 44.7,55.24 | U$7.3 72.39,9.27
  Bottom 1.27: IC3.5 IC3.4 IC3.13 IC3.12 IC4.5 IC4.4 IC4.13 IC4.12 53.34,13.84 45.21,5.71 45.21,1.02 25.4,1.02 FTDI-HEADER.6 25.4,3.17 25.4,3.3 12.57,3.3 C7.- | U$15.6 5.77,54.99 1.52,54.99 0.64,54.1 0.64,39.24 0.64,36.2 IC6.4
  Bottom 1.778: IC5.5 9.4,13.21 16,19.81 v16,25.4 16,27.05 C9.-
  other vias: 1.27,24.77 3.81,24.77 2.54,24.77 5.08,24.77 6.35,24.77 1.27,23.5 2.54,23.5 3.81,23.5 5.08,23.5 6.35,23.5 10.16,29.84 10.16,31.11 8.89,29.84 8.89,31.11 8.89,32.38 1.27,32.38 1.27,31.11 1.27,29.84 1.27,22.23 2.54,22.23 3.81,22.23 5.08,22.23 6.35,22.23 6.35,20.95 5.08,20.95 3.81,20.95 2.54,20.95 1.27,20.95 7.62,24.77 7.62,23.5 7.62,22.23 7.62,20.95 1.27,19.68 2.54,19.68 1.27,18.41 4.45,1.27 4.45,3.17 4.45,5.08 4.45,6.99 6.99,43.81 5.08,43.81 3.17,40.64 1.27,33.66 1.27,34.92 8.89,33.66 66.67,7.62 57.78,1.91 57.78,5.08 61.59,7.62 55.24,1.91 55.24,5.08 53.34,5.08 46.99,1.91 43.18,4.45 46.99,6.35 50.8,1.91 45.72,6.99 78.74,13.34 78.74,15.24 77.47,17.14 76.83,19.05 76.83,20.95 76.83,22.35 76.96,38.86 78.11,40.01 78.11,41.91 77.47,43.81 77.47,45.72 77.47,47.62 60.58,46.23 62.87,45.47 64.14,45.47 65.41,45.59 66.67,47.75 52.96,46.48 51.69,46.48 50.42,47.12 49.53,48.01 45.09,53.34 43.81,52.07 42.55,50.8 42.55,53.34 38.1,1.91 40.64,1.91 43.18,1.91 28.57,19.68 28.57,20.95 27.94,25.4 69.85,26.67 68.58,27.94 71.12,38.73 71.12,40.64 74.3,43.81 69.72,39.37 73.03,39.37 70.36,44.7 71.63,44.58 70.36,43.43 61.59,45.47 66.42,46.48 1.27,36.2 2.54,34.92 1.27,38.73 2.54,36.2 3.81,36.2 38.1,48.26 36.83,48.26 27.43,37.72 27.43,36.07 45.09,21.59 46.35,21.59 47.62,21.59 48.9,21.59 50.16,21.59 51.44,21.59 52.7,21.59 53.98,21.59 55.24,21.59 59.05,20.95 60.33,20.95 61.59,20.95 62.87,20.95 60.96,23.5 62.23,23.5 63.5,23.5 62.23,16.51 63.5,15.88 64.77,15.88 66.04,15.88 67.31,15.88 68.58,15.88 69.85,15.88 56.52,13.34 55.24,13.34 50.16,13.34 48.9,13.34 47.62,13.34 46.35,13.34 58.42,13.34 59.69,12.06 60.96,10.79 62.23,9.53 63.5,8.26 45.09,34.29 46.35,34.29 47.62,34.29 48.9,34.29 50.16,34.29 51.44,34.29 52.7,34.29 53.98,34.29 55.24,34.29 56.52,34.29 57.78,34.29 62.23,33.02 63.5,33.02 64.77,33.02 66.04,33.02 67.31,33.02 50.67,28.19 38.1,27.3 41.27,26.67 47.62,10.16 48.9,10.16 50.16,10.16 51.44,10.16 52.7,10.16 53.98,10.16 63.5,41.91 67.31,42.55 67.94,43.81 36.83,8.89 36.83,7.62 36.83,6.35 39.37,5.08 40.64,5.08 10.41,35.05 12.06,38.73 12.06,40.64 13.34,44.45 12.06,44.45 12.06,45.72 13.34,45.72 19.05,45.09 1.27,17.14 6.35,42.55 3.81,45.09 2.54,46.35 51.44,13.34 52.7,13.34 53.98,13.34 43.81,13.34 42.55,13.97 1.27,26.04 1.27,27.3 1.27,28.57 2.54,28.57 2.54,27.3 2.54,26.04 3.81,26.04 3.81,27.3 5.08,27.3 5.08,26.04 6.35,26.04 6.35,27.3 7.62,26.04 7.62,27.3 7.62,28.57 8.89,28.57 8.89,27.3 8.89,26.04 8.89,24.77 8.89,23.5 8.89,22.23 10.16,22.23 10.16,23.5 10.16,24.77 10.16,26.04 10.16,27.3 10.16,28.57 11.43,28.57 11.43,29.84 12.7,29.84 12.7,31.11 11.43,31.11 11.43,32.38 10.16,32.38 10.16,33.66 6.48,37.97 7.62,34.92 8,36.2 3.81,37.47 5.08,38.73 3.81,38.73 2.54,38.73 2.54,37.47 1.27,37.47 1.27,40.64 8.89,20.95 10.16,20.95 10.16,19.68 9.53,45.09 9.53,46.35 9.53,47.62 12.7,47.62 12.06,48.26 11.43,48.9 14.61,48.26 13.97,48.9 13.34,49.53 16.51,49.53 16.38,52.07 21.46,52.07 24,52.07 26.54,52.07 29.08,52.07 31.62,52.07 37.47,53.34 38.73,53.34 38.73,52.07 36.2,43.18 35.79,41.81 33.02,43.18 40.01,34.92 40.64,27.3 39.37,27.3 49.53,27.69 58.42,28.19 57.15,28.19 55.88,28.19 54.61,28.19 53.34,28.19 52.07,28.19 48.26,27.69 71.75,3.17 74.93,2.54 74.3,1.91 73.66,1.27 75.56,3.17 76.2,52.7 75.56,53.34 74.93,53.98 74.93,24.13 76.2,23.5 74.93,31.11 74.93,32.38 74.93,33.66 74.93,34.92 74.93,36.2 75.56,37.47 75.56,27.94 3.68,54.74 6.1,54.74 8.89,54.74 1.14,54.74
  pour Top (isolate 0.203): 0,56.01 80.01,56.01 80.01,0 0,0
  pour Bottom (isolate 0.203): 0,56.01 80.01,56.01 80.01,0 0,0
M1-RESET  (via drill 0.51)
  Top 0.203: IC1.29 37.06,38.5 37.34,38.23 37.97,38.23 v38.35,37.85 | v36.88,28.5 36.09,29.29 34.59,29.29 33.91,29.97 33.91,30.73 33.15,31.5 30.73,31.5 v30.35,31.88 | JP1.3 18.41,38.86 R1.1 20.32,38.99 20.32,36.58 J2.5
  Bottom 0.203: v38.35,37.85 39.24,36.96 40.89,36.96 41.66,36.2 41.66,31.9 42.09,31.47 42.09,30.76 39.83,28.5 v36.88,28.5 | v30.35,31.88 29.84,32.38 24.51,32.38 J2.5
M1-TX  (via drill 0.51)
  Top 0.203: IC1.31 35.47,39.91 35.81,40.26 36.7,40.26 v37.08,40.64 | v21.64,42.09 22.4,42.09 D5.C
  Bottom 0.203: v37.08,40.64 34.67,40.64 32.89,42.42 27.48,42.42 27.15,42.09 v21.64,42.09
M2-RESET  (via drill 0.51)
  Top 0.203: IC2.29 41.74,21.08 39.88,21.08 v39.37,21.59 | v22.1,32.89 20.7,34.29 20.7,34.42 R2.1 17.53,33.78 JP1.1
  Bottom 0.203: J1.5 22.99,25.78 22.99,28.32 23.24,28.57 | v39.37,21.59 37.72,21.59 36.83,22.48 36.83,22.99 34.92,24.89 30.99,24.89 27.3,28.57 23.24,28.57 | v22.1,32.89 22.61,32.89 23.24,32.26 23.24,28.57
M2-TX  (via drill 0.51)
  Top 0.203: IC2.31 43.02,22.7 v43.05,22.73 | v31.37,36.58 30.99,36.96 30.99,39.88 27.94,42.93 D6.C
  Bottom 0.203: v43.05,22.73 42.04,22.73 38.48,26.29 37.21,26.29 36.07,27.43 36.07,29.34 33.15,32.26 33.15,34.42 31.37,36.2 v31.37,36.58
M-RX  (via drill 0.51)
  Top 0.203: IC2.30 40.96,21.9 v40.13,22.73 | v31.75,24 31.75,22.61 29.84,20.7 29.84,19.18 30.35,18.67 30.35,17.4 27.94,14.99 v19.94,14.99 | IC1.30 36.27,38.3 v35.56,37.59 | R4.1 24.64,49.53 22.61,49.53 21.77,48.69 D3.A 20.83,47.75 v20.83,47.22 | D2.A 20.07,5.21 v20.32,5.46
  Bottom 0.203: v40.13,22.73 40.26,22.61 40.26,21.21 39.75,20.7 37.97,20.7 36.32,22.35 36.32,22.86 34.8,24.38 32.13,24.38 v31.75,24 | 20.83,41.27 19.94,40.39 v19.94,14.99 19.94,5.84 v20.32,5.46 | v35.56,37.59 35.56,38.35 32,41.91 27.56,41.91 26.92,41.27 20.83,41.27 | 20.83,41.27 v20.83,47.22
MADIR  (via drill 0.51)
  Top 0.203: IC1.12 37.06,30.07 38.05,29.08 38.35,29.08 38.96,28.47 43.36,28.47 v43.76,28.07
  Bottom 0.203: v43.76,28.07 43.56,28.27 43.56,29.54 43.97,29.95 43.97,32.33 43.61,32.69 43.61,37.16 45.31,37.16 45.39,37.08 46.15,37.08 47.17,38.1 IC3.7
MAEN  (via drill 0.51)
  Top 0.203: v35.81,33.66 36.07,33.4 38.61,33.4 40.27,31.74 IC1.16 40.8,30.1 44.65,30.1 45.29,29.46 46.23,29.46 46.99,30.23 46.99,30.73 47.75,31.5 49.71,31.5 51,32.79 58.09,32.79 59.64,34.34 v59.64,34.92
  Bottom 0.203: J2.1 23.24,38.73 25.02,38.73 27.69,41.4 29.21,41.4 33.66,36.96 33.66,35.81 35.18,34.29 v35.81,33.66 | IC3.1 61.77,36.37 61.77,34.49 61.39,34.11 60.45,34.11 v59.64,34.92
MAO0
  Top 0.61: U$3.1 69.22,41.91 64.14,36.83 59.69,36.83 IC3.3
MAO1
  Top 0.61: U$3.2 71.36,48.01 73.79,48.01 74.55,47.24 74.55,45.97 64.52,35.94 59.18,35.94 58.42,36.7 52.2,36.7 IC3.6
MAPWM  (via drill 0.51)
  Top 0.203: v60.96,34.92 60.81,34.92 58.27,32.38 51.18,32.38 49.53,30.73 49.53,30.23 48.77,29.46 47.4,29.46 46.58,28.65 44.93,28.65 44.3,29.29 39.42,29.29 38.73,29.97 38.73,30.56 IC1.14
  Bottom 0.203: IC3.2 v60.96,34.92
MAT0  (via drill 0.51)
  Top 0.203: U$3.5 72.9,46.74 71.63,45.47 70.87,45.47 70.23,46.1 70.23,47.24 69.6,47.88 68.71,47.88 68.2,47.37 68.2,46.35 65.91,44.07 50.04,44.07 48.26,45.85 45.21,45.85 44.58,45.21 43.05,45.21 41.66,43.81 41.66,42.67 40.77,41.78 39.75,41.78 39.24,42.29 38.61,42.29 v37.72,43.18 | v36.83,37.47 36.07,36.7 35.18,36.7 34.16,37.72 34.16,38.61 34.66,39.11 IC1.32
  Bottom 0.203: v37.72,43.18 38.1,42.8 38.1,39.24 v36.83,37.47
MAT1  (via drill 0.51)
  Top 0.203: v71.25,50.42 69.85,50.42 69.09,49.66 69.09,48.9 67.69,47.5 67.69,46.48 65.79,44.58 50.16,44.58 48.39,46.35 45.09,46.35 44.45,45.72 42.93,45.72 41.15,43.94 41.15,42.8 40.64,42.29 39.88,42.29 v38.99,43.18 | IC1.2 33.2,36.96 33.33,36.83 34.42,36.83 34.8,36.45 34.8,35.94 37.21,35.94 37.72,36.45 37.85,36.45 38.23,36.83 38.86,36.83 v39.88,37.85
  Bottom 0.203: U$3.6 73.91,49.28 72.77,50.42 v71.25,50.42 | v38.99,43.18 38.99,41.4 38.61,41.02 38.61,39.75 39.88,38.48 v39.88,37.85
MBDIR
  Top 0.203: IC1.13 37.87,29.95 38.23,29.59 38.48,29.59 39.19,28.88 44.12,28.88 44.76,28.25 46.76,28.25 47.57,29.06 48.95,29.06 49.35,29.46 58.85,29.46 59.87,30.48 IC3.15
MBEN  (via drill 0.51)
  Top 0.203: IC1.17 41.27,31.64 v41.27,31.11 41.88,30.5 45.7,30.5 IC3.9
  Bottom 0.203: J2.3 22.99,36.2 24.89,36.2 25.65,36.96 25.65,38.1 27.94,40.39 28.96,40.39 32.64,36.7 32.64,35.56 33.66,34.54 33.66,32.38 34.98,31.06 41.22,31.06 v41.27,31.11
MBO0
  Top 0.61: U$4.1 66.42,35.05 62.61,35.05 61.47,33.91 60.68,33.91 58.52,31.75 52.07,31.75 IC3.11
MBO1
  Top 0.61: U$4.2 70.48,35.58 70.48,33.02 69.22,31.75 59.69,31.75 IC3.14
MBPWM  (via drill 0.51)
  Top 0.203: IC3.10 47.83,30.48 46.41,29.06 45.11,29.06 44.48,29.69 39.78,29.69 39.47,30 IC1.15 39.47,31.91 38.48,32.89 36.45,32.89 36.32,32.77 v34.54,32.77
  Bottom 0.203: v34.54,32.77 34.54,34.29 33.15,35.69 33.15,36.83 29.08,40.89 27.81,40.89 24.38,37.47 J2.4
MBT0  (via drill 0.51)
  Top 0.203: v66.04,40.39 66.04,41.53 64.01,43.56 49.91,43.56 48.13,45.34 45.34,45.34 44.7,44.7 43.18,44.7 42.16,43.69 42.16,42.55 40.89,41.27 37.85,41.27 37.59,41.53 36.7,41.53 35.94,40.77 34.67,40.77 34.04,40.13 34.04,39.12 33.15,38.23 33.15,37.75 IC1.1
  Bottom 0.203: U$4.5 69.22,34.29 68.2,35.31 68.2,37.47 66.04,39.62 v66.04,40.39
MBT1  (via drill 0.51)
  Top 0.203: IC1.9 34.66,29.98 34.95,29.69 36.85,29.69 37.87,28.68 38.18,28.68 38.79,28.07 42.6,28.07 43.41,27.25 44.12,27.25 44.7,27.84 46.94,27.84 47.75,28.65 49.12,28.65 49.53,29.06 59.03,29.06 59.44,29.46 69.85,29.46 v70.1,29.21
  Bottom 0.203: v70.1,29.21 70.1,31.11 U$4.6
MCDIR  (via drill 0.51)
  Top 0.203: IC2.12 34.18,21.1 v35.31,22.23
  Bottom 0.203: v35.31,22.23 35.81,22.23 37.85,20.19 41.78,20.19 44.07,22.48 44.07,23.24 45.21,24.38 47.24,24.38 IC4.7
MCEN  (via drill 0.51)
  Top 0.203: IC2.16 33.17,17.3 v33.02,17.14 | v45.21,14.99 46.99,14.99 49.66,17.65 49.66,18.29 50.93,19.56 55.75,19.56 60.58,24.38 62.48,24.38 IC4.1
  Bottom 0.203: J1.1 20.45,28.32 20.45,24.38 21.34,23.5 22.86,23.5 23.37,22.99 23.37,21.72 28.07,17.02 32.89,17.02 v33.02,17.14 34.29,17.14 35.05,16.38 44.32,16.38 45.21,15.49 v45.21,14.99
MCO0
  Top 0.61: U$5.1 65.28,27.05 60.58,27.05 58.93,25.4 IC4.3
MCO1
  Top 0.61: U$5.2 71.75,22.48 69.85,24.38 69.22,24.38 65.66,27.94 60.2,27.94 58.93,26.67 52.07,26.67 IC4.6
MCPWM  (via drill 0.51)
  Top 0.203: IC4.2 55.63,20.07 48.77,20.07 47.24,18.54 47.24,16.64 v46.99,16.38 | IC2.14 33.84,19.5 34.16,19.18 34.16,18.92 v34.54,18.54
  Bottom 0.203: v34.54,18.54 34.54,18.29 35.43,17.4 44.58,17.4 45.59,16.38 v46.99,16.38
MCT0  (via drill 0.51)
  Top 0.203: U$5.5 66.02,22.23 v59.69,22.23 | v58.04,23.88 50.8,23.88 49.4,25.27 49.4,25.78 48.77,26.42 45.29,26.42 42.37,23.5 IC2.32
  Bottom 0.203: v59.69,22.23 v58.04,23.88
MCT1  (via drill 0.51)
  Top 0.203: v73.28,21.34 73.28,22.1 72.26,23.11 72.14,23.11 70.23,25.02 69.6,25.02 66.04,28.57 59.94,28.57 58.65,27.28 51.79,27.28 51.33,26.82 45.11,26.82 43.56,25.27 41.4,25.27 40.64,26.04 39.88,26.04 39.47,25.62 IC2.2
  Bottom 0.203: U$5.6 72.77,19.05 72.77,20.83 v73.28,21.34
MDDIR  (via drill 0.51)
  Top 0.203: v57.78,14.48 57.4,14.86 47.5,14.86 47.12,14.48 45.97,14.48 45.59,14.1 44.83,14.1 44.32,14.61 43.56,14.61 42.8,15.37 42.8,16.51 43.81,17.53 v43.81,18.29 | v34.67,19.94 34.31,20.3 IC2.13
  Bottom 0.203: IC4.15 60.96,17.65 v57.78,14.48 | v43.81,18.29 43.43,17.91 35.69,17.91 35.43,18.16 35.43,19.18 v34.67,19.94
MDEN  (via drill 0.51)
  Top 0.203: 34.66,16.25 IC2.17 34.51,16.26 v33.91,16.26 | v22.48,22.61 21.59,23.5 21.34,23.5 20.45,24.38 20.45,26.04 J1.3 | IC4.9 43.94,16 v43.94,15.49
  Bottom 0.203: v22.48,22.61 22.48,21.97 27.94,16.51 32.38,16.51 32.64,16.26 v33.91,16.26 34.29,15.88 43.56,15.88 v43.94,15.49
MDO0
  Top 0.61: U$7.1 73.03,8 69.47,8 67.94,9.53 64.9,9.53 58.42,16 52.58,16 IC4.11
MDO1
  Top 0.61: 73.66,6.73 75.56,8.64 75.56,9.91 74.42,11.05 65.15,11.05 IC4.14
  Top 0.813: U$7.2 73.66,6.73
MDPWM  (via drill 0.51)
  Top 0.203: v31.75,19.94 31.75,19.3 32.35,18.7 IC2.15
  Bottom 0.203: IC4.10 48.26,16.26 47.5,15.49 46.61,15.49 46.23,15.88 45.47,15.88 44.45,16.89 35.18,16.89 34.42,17.65 34.04,17.65 v31.75,19.94 31.75,22.73 30.86,23.62 30.86,24.38 27.94,27.3 J1.4
MDT0  (via drill 0.51)
  Top 0.203: U$7.5 69.47,9.27 68.58,10.16 65.15,10.16 58.55,16.76 52.83,16.76 52.07,17.53 v52.07,18.67 | v38.86,19.3 38.86,20.19 38.48,20.57 38.48,22.35 40.26,24.13 IC2.1
  Bottom 0.203: v52.07,18.67 51.56,18.67 51.44,18.8 49.53,18.8 49.02,19.3 45.97,19.3 45.09,20.19 43.56,20.19 42.29,18.92 39.24,18.92 v38.86,19.3
MDT1  (via drill 0.51)
  Top 0.203: U$7.6 69.22,7.24 67.56,8.89 64.64,8.89 58.17,15.37 52.2,15.37 50.93,16.64 v49.91,16.64 | v34.42,23.5 IC2.9
  Bottom 0.203: v49.91,16.64 49.66,16.89 49.66,17.91 48.77,18.8 45.72,18.8 44.83,19.68 43.81,19.68 42.55,18.41 37.59,18.41 34.42,21.59 v34.42,23.5
N$1
  Top 1.778: D1.4 11.68,6.48 11.68,7.62 | IC5.2 5.41,19.05 7.87,19.05 11.68,15.24 11.68,7.62 | U$14.P$2 16.89,7.62 11.68,7.62
N$2
  Top 0.203: FTDI-HEADER.1 12.7,3.56 C5.1
N$3
  Top 0.203: R8.1 79.5,52.83 79.5,48.39 79.12,48.01 LED2.1
N$4
  Top 0.203: R9.1 79.5,3.05 79.5,7.62 79.12,8 LED1.1
N$5
  Top 0.203: C1.1 27.43,30.29 27.43,34.67 28.45,35.69 | 28.45,35.69 XTL1.2 | 28.45,35.69 31.37,32.77 32.64,32.77 32.8,32.92 IC1.7
N$6
  Top 0.203: U$15.13 18.92,51.99 18.92,53.85 19.56,54.48 73.03,54.48 75.44,52.07 75.44,51.44 76.58,50.29 76.58,43.18 76.83,42.93 76.83,40.26 74.04,37.47 74.04,31.75 72.14,29.84 72.14,25.53 75.69,21.97 75.69,17.02 77.34,15.37 77.34,7.75 75.95,6.35 75.95,3.94 78.74,1.14 R9.2
N$7
  Top 0.203: IC1.8 33.04,32.26 32.38,32.26 31.24,32.26 30.29,33.21 | 30.29,33.21 29.34,34.16 XTL1.1 | C2.1 31.56,30.99 29.97,30.99 29.46,31.5 29.46,32.38 30.29,33.21
N$8
  Top 0.203: Q11.1 44.89,41.72 43.94,40.77 R15.2
N$9
  Top 0.406: Q20.3 33.91,47.62 R22.2
N$10
  Top 0.203: R25.2 29.08,44.2 26.54,44.2 25.59,45.15 Q21.1
N$11
  Top 0.203: U$15.10 12.57,52.45 11.3,51.18 11.3,50.29 14.1,47.5 18.69,47.5 20.42,45.77 R7.1 20.7,45.52 R6.2
N$12
  Top 0.203: U$15.12 16.84,54.99 78.87,54.99 R8.2
N$13
  Top 0.203: R13.1 49.53,41.02 | 49.53,41.02 R14.1 | Q11.3 48.22,41.02 49.53,41.02
N$14
  Top 0.203: XTL2.2 26.67,19.94 26.67,27.3 C3.1 28.13,28.45 33.66,28.45 33.66,27.43 35.47,25.62 IC2.7
N$15
  Top 0.203: XTL2.1 32.7,27.24 C4.1 34.66,25.34 IC2.8
N$16
  Top 0.203: R24.1 29.08,47.12 28.45,47.75 | 28.45,47.75 R23.1 | Q21.3 28.15,47.45 28.45,47.75
N$17
  Top 0.203: Q20.1 29.53,48.58 R23.2
N$20
  Top 0.406: Q30.3 25.4,8.51 R32.2
N$21
  Top 0.203: Q31.1 30.52,8.34 29.46,9.4 29.08,9.4 28.32,10.16 R35.2
N$22
  Top 0.203: R13.2 51.12,41.97 Q10.1
N$23
  Top 0.203: R33.1 23.11,4.83 | 23.11,4.83 R34.1 | Q31.3 27.9,6.14 27.05,6.99 25.65,6.99 25.4,6.73 25.4,5.08 25.15,4.83 23.11,4.83
N$24
  Top 0.203: R33.2 23.73,6.86 Q30.1
N$25
  Top 0.203: Q10.3 54.82,41.56 55.88,42.62 57.23,42.62 57.28,42.57 57.28,41.25 57.4,41.25 58.29,40.36 58.29,40.06 59.23,39.12 60.68,39.12 61.47,39.9 R12.2
N$26
  Top 0.406: R42.2 29.13,2.03 Q40.3
N$29
  Bottom 0.406: SJ1.1 10.22,38.92 U$12.1
N$30
  Bottom 0.406: SJ1.2 9.34,35.62 R52.2
N$31
  Top 0.203: D51.A 16.89,42.42 11.68,42.42 11.54,42.56 10.15,42.56 8.26,44.45 U$12.6 8.26,48.13 6.6,49.78 5.89,49.78 U$15.3
N$32
  Top 0.203: D50.A 15.48,43.58 U$12.5 10.79,47.42 U$15.5
N$33
  Top 0.203: Q41.1 35.11,8.82 R45.2
N$34
  Top 0.203: R43.1 33.66,4.83 | 33.66,4.83 33.87,4.83 Q41.3 | R44.1 33.66,4.83
N$35
  Top 0.203: R43.2 30.58,4.83 Q40.1
REG_OUT
  Top 1.27: F1.1 18.03,29.33 18.03,25.4 | U$14.P$1 18.03,25.4 | C8.1 17.82,25.4 18.03,25.4
  Top 1.778: U$14.P$1 13.97,21.97 C9.+
  Bottom 1.778: C9.+ 13.97,20.98 8.2,15.21 IC6.3 7.62,16.18 IC5.4
RPI-FTDI-RX  (via drill 0.51)
  Top 0.203: FTDI-HEADER.2 15.62,1.52 15.62,5.71 v15.37,5.97 | D6.A 24.64,43.13 24.64,43.18 24.13,43.18 23.7,43.61 20.7,43.61 | R3.1 18.16,40.89 v18.57,41.3 19.56,42.29 D5.A 20.62,43.61 20.7,43.61 | R7.2 20.7,43.61
  Bottom 0.203: v15.37,5.97 15.37,15.11 18.92,18.67 18.92,28.83 14.99,32.77 14.99,38.99 17.3,41.3 v18.57,41.3
RPI-TX
  Top 0.203: D4.A 21.89,46.41 20.37,46.41 18.41,48.36 D3.C 15.49,48.64 13.84,50.29 13.84,53.72 13.08,54.48 11.25,54.48 U$15.8
S1ADC
  Top 0.203: IC1.19 42.79,33.73 46.99,37.92 46.99,38.35 47.75,39.12 55.58,39.12 D10.A 56.39,40.44 R11.1
S1ANA  (via drill 0.51)
  Top 0.203: R11.2 v58.47,41.94 R10.1 | v63.8,40.18 R12.1
  Bottom 0.203: U$8.1 54.48,45.92 v58.47,41.94 60.22,40.18 v63.8,40.18
S1POW  (via drill 0.51)
  Top 0.203: IC1.10 35.43,30.66 v35.43,31.88 | v38.1,35.56 38.73,36.2 39.12,36.2 39.88,36.96 40.39,36.96 40.77,37.34 40.77,38.23 41.02,38.48 41.02,40.01 44.45,43.43 44.45,43.81 45.47,44.83 48.01,44.83 48.51,44.32 48.51,43.56 46.86,41.91 46.86,41.02 46.61,40.77 44.96,40.77 44.7,40.51 44.7,39.62 43.94,38.86 R15.1
  Bottom 0.203: v35.43,31.88 35.43,32 36.2,32.77 36.32,32.77 36.7,33.15 36.7,34.42 37.85,35.56 v38.1,35.56
S1SCL  (via drill 0.51)
  Top 0.203: v43.56,43.81 42.67,42.93 42.67,42.42 41.02,40.77 41.02,40.64 40.27,39.88 IC1.25 | U$8.5 57.42,45.59 50.55,45.59 48.01,48.13 47.24,48.13 v46.35,47.24
  Bottom 0.203: v43.56,43.81 44.32,43.05 46.23,43.05 46.74,43.56 46.74,46.86 v46.35,47.24
S1SDA  (via drill 0.51)
  Top 0.203: U$8.6 59.56,47.37 59.69,47.24 59.69,46.23 58.55,45.09 50.29,45.09 48.13,47.24 v47.62,47.24 | v47.62,43.94 47.12,43.94 46.23,43.05 45.34,43.05 42.04,39.75 42.04,38.86 42.8,38.1 42.8,37.34 42.42,36.96 41.79,36.96 IC1.23
  Bottom 0.203: v47.62,47.24 v47.62,43.94
S2ADC  (via drill 0.51)
  Top 0.203: IC1.22 40.96,36.12 40.89,36.07 v40.39,36.07 | v33.15,39.5 33.15,41.15 D20.A 35.05,43 R21.1
  Bottom 0.203: v40.39,36.07 40.01,36.45 39.12,36.45 38.61,36.96 37.59,36.96 36.07,35.43 35.31,35.43 34.67,36.07 34.67,37.97 v33.15,39.5
S2ANA
  Top 0.203: R20.1 R21.2 R22.1
  Top 0.406: R22.1 38.61,45.59 U$9.1
S2POW  (via drill 0.51)
  Top 0.203: IC1.11 36.27,31.57 v36.7,32 | v31.88,40.01 31.5,40.01 29.34,42.16 R25.1
  Bottom 0.203: v36.7,32 36.7,32.51 37.21,33.02 37.21,34.04 37.85,34.67 38.48,34.67 38.99,35.18 38.99,35.94 38.48,36.45 37.72,36.45 36.2,34.92 35.18,34.92 34.16,35.94 34.16,37.08 32.13,39.12 32.13,39.75 v31.88,40.01
S2SCL  (via drill 0.51)
  Top 0.203: v39.5,40.39 39.47,40.35 IC1.26 | U$9.5 43.31,46.74 40.26,43.69 v40.26,43.18
  Bottom 0.203: v40.26,43.18 40.26,41.15 v39.5,40.39
S2SDA  (via drill 0.51)
  Top 0.203: IC1.24 41.53,37.95 41.53,39.88 45.59,43.94 v45.85,43.94
  Bottom 0.203: U$9.6 44.96,49.15 44.96,44.83 v45.85,43.94
S3ADC
  Top 0.203: R31.1 30.66,14.22 D30.A 30.99,14.15 32.21,15.37 36.07,15.37 36.27,15.56 IC2.19
S3ANA  (via drill 0.51)
  Top 0.406: R32.1 27.3,12.19 29.59,12.19 | 29.59,12.19 R30.1 | 29.59,12.19 R31.2 | 29.59,12.19 v31.5,12.19
  Bottom 0.406: U$10.1 44.83,10.41 42.55,12.7 32,12.7 v31.5,12.19
S3POW
  Top 0.203: R35.1 28.32,14.73 30.86,17.27 30.86,18.8 30.35,19.3 30.35,20.57 32.51,22.73 33.14,22.73 IC2.10
S3SCL
  Top 0.203: U$10.5 40.75,15.35 41.78,16.38 41.78,17.88 IC2.25
S3SDA
  Top 0.203: U$10.6 39.75,8.13 39.24,8.64 39.24,10.03 39.5,10.29 39.5,16.38 IC2.23
S4ADC
  Top 0.203: R41.1 34.34,14.1 D40.A 36.75,13.77 38.61,15.62 38.61,16.35 IC2.22
S4ANA  (via drill 0.51)
  Top 0.203: R41.2 33.15,12.06 R40.1
  Top 0.406: R42.1 36.58,2.03 38.1,3.56 v38.1,9.4 35.43,12.06 33.15,12.06 | U$11.1 57.15,11.68 v42.16,11.68
  Bottom 0.406: v42.16,11.68 40.39,11.68 v38.1,9.4
S4POW  (via drill 0.51)
  Top 0.203: v30.73,15.49 30.73,16.51 31.37,17.14 31.37,18.92 30.86,19.43 30.86,20.45 32.26,21.84 33.12,21.84 IC2.11 | v33.02,8.89 R45.1
  Bottom 0.203: v30.73,15.49 30.73,12.7 30.61,12.57 30.61,11.3 v33.02,8.89
S4SCL
  Top 0.203: IC2.26 42.51,18.7 42.8,18.41 42.8,17.4 42.29,16.89 42.29,16.26 41.27,15.24 41.27,11.3 41.78,10.79 45.47,10.79 49.02,7.24 53.45,7.24 U$11.5
S4SDA
  Top 0.203: U$11.6 48.9,6.73 45.34,10.29 42.29,10.29 41.77,9.77 41.77,8.75 41.27,8.26 40.26,8.26 39.73,8.79 39.73,9.88 40.26,10.41 IC2.24
VCC  (via drill 0.51)
  Top 0.203: IC3.8 46.48,38.86 46.74,38.86 47.5,39.62 50.93,39.62 51.05,39.75 | R14.2 51.05,39.75 | Q10.2 52.3,39.75 51.05,39.75 | R24.2 30.48,45.59 v30.73,45.85 | R44.2 31.37,3.56 30.99,3.17 29.23,3.17 Q40.2 | R34.2 25.02,4.06 25.65,4.06 26.91,5.32
  Top 0.406: Q20.2 30.9,46.02 v30.73,45.85 | Q40.2 27.96,4.28 26.91,5.32 Q30.2 26.35,5.91 v26.29,5.97
  Top 1.27: C6.1 3.06,10.97 JP2.2
  Bottom 0.406: v30.73,45.85 30.73,44.96 | v26.29,5.97 26.29,5.21 25.53,4.45 13.21,4.45 8.89,8.76 8.89,10.92 | R52.1 13.84,35.18
  Bottom 1.27: IC4.8 44.53,25.4 42.42,27.51 42.42,28.57 42.62,28.78 42.62,29.95 43.03,30.35 43.03,31.93 42.67,32.23 42.67,38.1 | 42.67,38.1 IC3.8 | 42.67,38.1 41.66,39.12 41.66,43.81 40.89,44.58 31.11,44.58 30.73,44.96 23.27,44.96 22.23,46 22.23,48.01 21.67,48.56 19.99,48.56 13.84,42.42 13.84,35.18 13.84,31.88 17.78,27.94 17.78,19.05 9.65,10.92 8.89,10.92 C7.+
  Bottom 1.778: C7.+ 7.44,10.97 JP2.2 1.68,11.38 IC5.1 2.54,14.07 IC6.1

### Text on the board
tPlace: Dexter Industries BrickPi